# EAGLE schematic rapidshark-battery-conn-mk-2.0 (EAGLE 6.5.0)
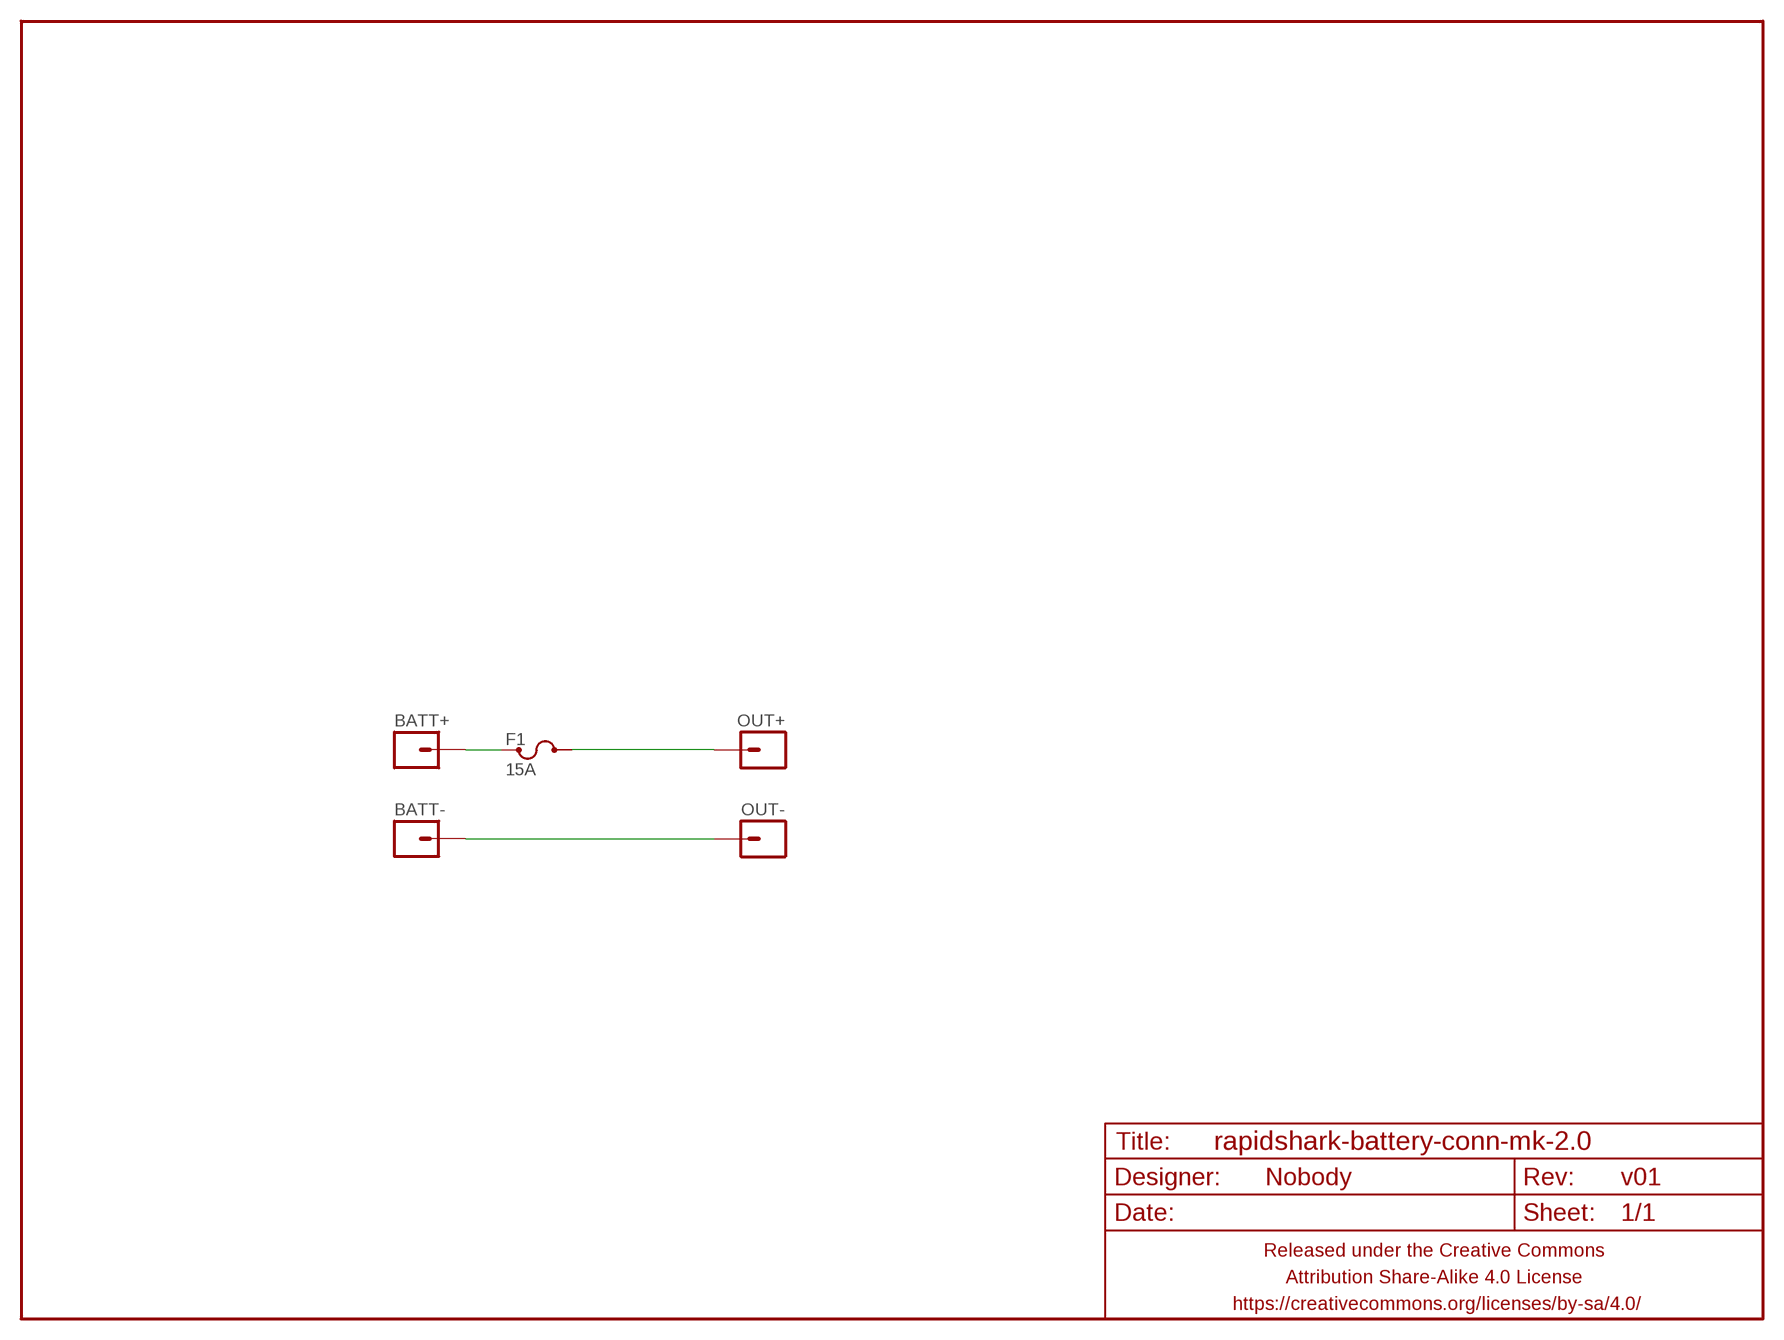
[diagram p0: schematic, sheet 1]

## Parts
BATT+  M01PTH-2.3MM  [1X01-2.3MM]
BATT-  M01PTH-2.3MM  [1X01-2.3MM]
F1  15A  FUSEMINI-AUTO  [KEYSTONE-MINI-AUTO-FUSE-HOLDER]
FRAME1  FRAME-LETTERNO_PACKAGE  [DUMMY]
OUT+  M0112AWG  [1X01-12AWG]
OUT-  M0112AWG  [1X01-12AWG]

## Nets
BATT+: BATT+.1 F1.P1@1 F1.P1@2
BATT-: BATT-.1 OUT-.1
OUT+: F1.P2@1 F1.P2@2 OUT+.1

## Library data of the parts
BATT+ BATT- OUT+ OUT- = A_butts:M01: Header 1 Standard 1-pin 0.1" header. Use with straight break away headers (SKU : PRT-00116), right angle break away headers (PRT-00553), swiss pins (PRT-00743), machine pins (PRT-00117), and female headers (PRT-00115).
F1 = A_butts:FUSE
FRAME1 = A_butts:FRAME-LETTER: Schematic Frame Standard 8.5x11 US Letter frame; DESIGNER: Nobody; VERSION: v01